# EasyEDA Pro project busmaster-v102.eprj, board bus-board
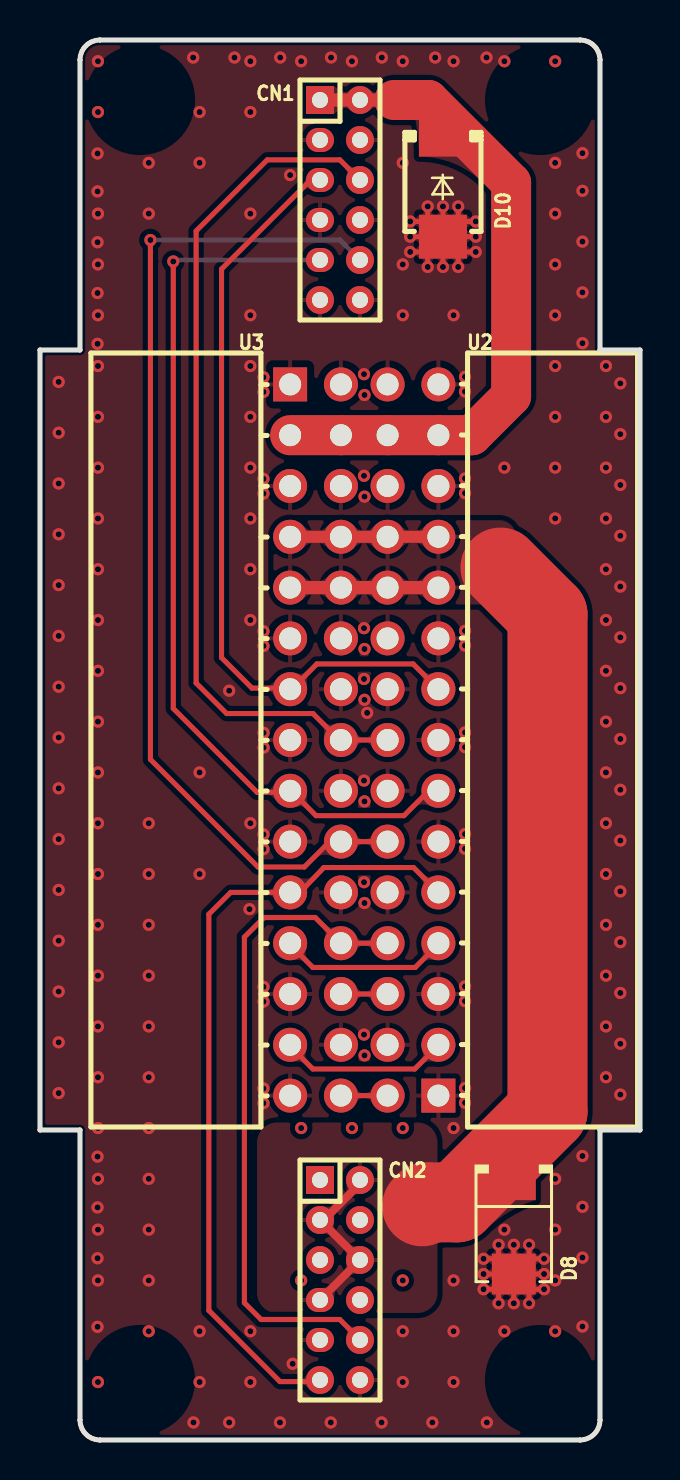
[diagram p3: board, top side]
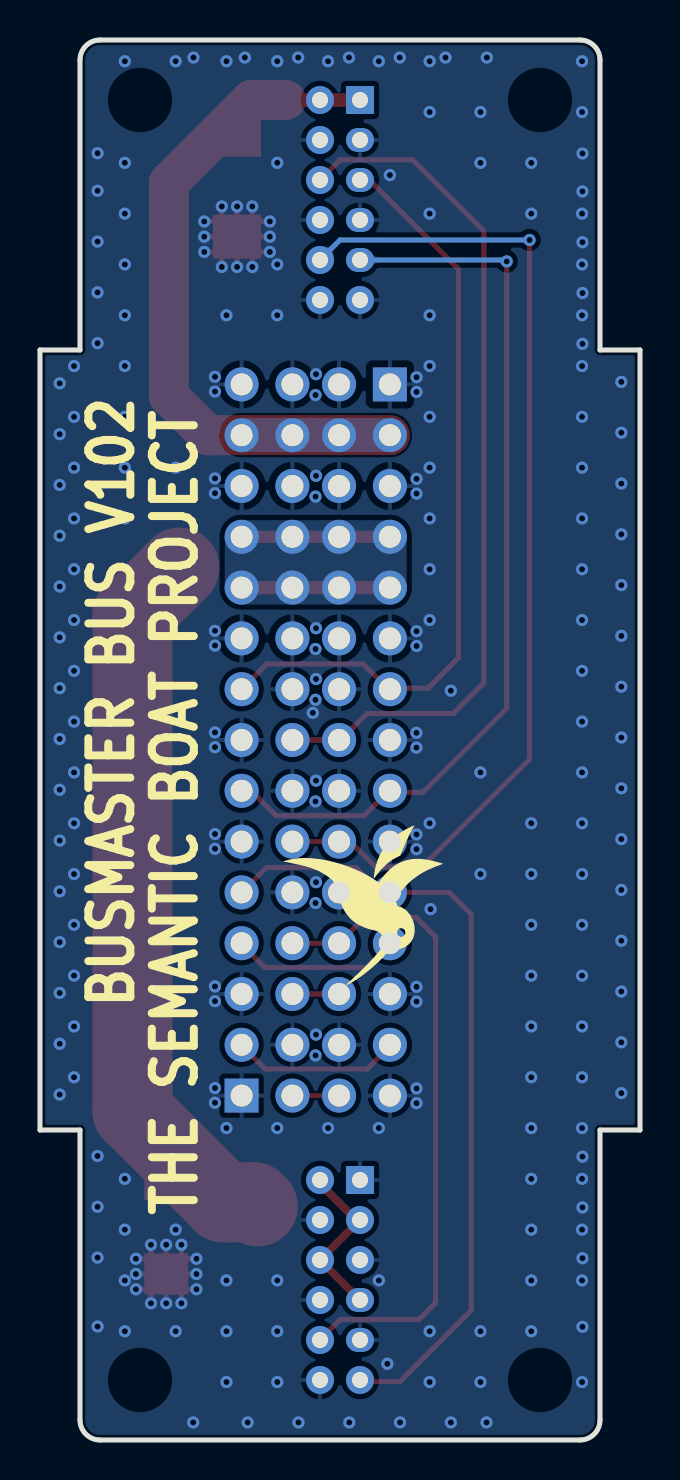
[diagram p4: board, bottom side, seen from below]

Outline 30 x 70 mm; copper layers: Top Layer, Bottom Layer. Coordinates in mm from the lower left corner of the outline.
Outline path: 0,54.5 2,54.5 2,69 arc(2.29,69.71) 3,70 27,70 arc(27.71,69.71) 28,69 28,54.5 30,54.5 30,15.5 28,15.5 28,1 arc(27.71,0.29) 27,0 3,0 arc(2.29,0.29) 2,1 2,15.5 0,15.5 0,54.5
Stack: Top Layer 0.035mm / Dielectric1 1.51mm FR4 er 4.5 / Bottom Layer 0.035mm

## Design rules (mm)
net GND: power
net +5V: power
net +12V: power
template: Custom Config
spacing copperThickness1oz (default): track to track 0.102, other pairs 0.152 to 0.3
spacing copperThickness2oz: track to track 0.203, other pairs 0.152 to 0.3
spacing copperThicknessInner0.5oz: track to track 0.089, other pairs 0.152 to 0.3
track width copperThickness1oz (default): min 0.102, default 0.254, max 5
track width copperThickness2oz: min 0.203, default 0.254, max 2.54
track width copperThickness0.5oz: min 0.089, default 0.254, max 2.54
differential pair differentialPair (default): width min 0.127, default 0.254, max 2.54; gap min 0.152, default 0.152
via viaSize (default): diameter min 0.3, default 0.61, max 10; hole min 0.2, default 0.305, max 6.3

## Placement (name value [footprint] x y rotation side)
CN1  PH2.0-01-06PZS  [HDR-TH_12P-P2.00-V-M-R2-C6-S2.00#2]  15 62 270 top
CN2  PH2.0-01-06PZS  [HDR-TH_12P-P2.00-V-M-R2-C6-S2.00]  15 8 270 top
D8  SMBJ5.0A  [SMB_L4.6-W3.6-LS5.3-RD]  23.69 10.66 270 top
D10  P6SMB20A  [SMB_L4.5-W3.6-LS5.4-RD]  20.15 62.72 270 top
U2  PM254-2-15-W-8.5  [HDR-TH_30P-P2.54-H-F-R2-C15-W8.5]  18.65 35 90 top
U3  PM254-2-15-W-8.5  [HDR-TH_30P-P2.54-H-F-R2-C15-W8.5]  13.78 35 270 top

## Footprints (pads in the part's own frame, mm; a bottom-side part is the same pattern mirrored in y, then rotated)
HDR-TH_12P-P2.00-V-M-R2-C6-S2.00
  rect 1.4x1.4 hole 0.8: 1(-5,-1)
  round 1.4 hole 0.8: 2(-5,1) 3(-3,-1) 4(-3,1) 5(-1,-1) 6(-1,1) 8(1,1) 10(3,1) 11(5,-1) 12(5,1)
  oval 1.2x1.4 hole 0.8: 7(1,-1) 9(3,-1)
HDR-TH_12P-P2.00-V-M-R2-C6-S2.00#2
  rect 1.4x1.4 hole 0.8: 1(-5,-1)
  round 1.4 hole 0.8: 2(-5,1) 4(-3,1) 6(-1,1) 8(1,1) 10(3,1) 11(5,-1) 12(5,1)
  oval 1.2x1.4 hole 0.8: 3(-3,-1) 5(-1,-1) 7(1,-1) 9(3,-1)
HDR-TH_30P-P2.54-H-F-R2-C15-W8.5
  rect 1.7x1.7 hole 1.1: 1(-17.78,-1.27)
  round 1.7 hole 1.1: 2(-17.78,1.27) 3(-15.24,-1.27) 4(-15.24,1.27) 5(-12.7,-1.27) 6(-12.7,1.27) 7(-10.16,-1.27) 8(-10.16,1.27) 9(-7.62,-1.27) 10(-7.62,1.27) 11(-5.08,-1.27) 12(-5.08,1.27) 13(-2.54,-1.27) 14(-2.54,1.27) 15(0,-1.27) 16(0,1.27) 17(2.54,-1.27) 18(2.54,1.27) 19(5.08,-1.27) 20(5.08,1.27) 21(7.62,-1.27) 22(7.62,1.27) 23(10.16,-1.27) 24(10.16,1.27) 25(12.7,-1.27) 26(12.7,1.27) 27(15.24,-1.27) 28(15.24,1.27) 29(17.78,-1.27) 30(17.78,1.27)
SMB_L4.5-W3.6-LS5.4-RD
  rect 2.2x2.4 smd: 1(-2.551,0) 2(2.551,0)
SMB_L4.6-W3.6-LS5.3-RD
  rect 2.047x2.192 smd: 1(-2.361,0) 2(2.361,0)

## Nets
As in the schematic.

## Via types
v1: diameter 0.61, hole 0.305, Top Layer to Bottom Layer, 243 vias

## Routing (per net, layer and track width the routed paths; a pad name or vN(x,y) marks a point on that pad's centre or on a via; arc(x,y) is an arc through that point)
+5V: length 59.8
  Top Layer w0.4: CN2.2 16,12.82 14.18,11 CN2.3 CN2.6 CN2.7
  Top Layer w0.61: U3.7 U3.8 U2.24 U2.23
  Top Layer w0.66: U2.21 U2.22 U3.10 U3.9
  Top Layer w4: 23.02,43.62 25.38,41.27 25.38,16.42 20.83,11.88 19.31,11.88 19.11,11.68
+12V: length 33.3
  Top Layer w0.66: CN1.1 CN1.2 17.21,67
  Top Layer w2: U3.3 U3.4 U2.28 U2.27 21.6,50.24 23.56,52.2 23.56,62.86 19.42,67 17.71,67
GND: length 27.2
  Top Layer w0.254: v1(20.15,61.68) D10.2 ; D10.2 v1(21.79,60.17) ; D10.2 v1(18.51,60.17) ; D10.2 v1(20.15,58.65) ; D10.2 20.91,59.4 ; v1(22.18,9.06) 22.93,9.06 v1(22.93,9.76) ; v1(18.51,59.4) 19.39,59.4 v1(19.39,58.65) ; v1(21.79,59.4) 20.91,59.4 ; 20.91,59.4 v1(20.91,58.65) ; v1(25.2,7.54) 24.45,7.54 v1(24.45,6.84) ; v1(22.93,6.84) 22.93,7.54 v1(22.18,7.54) ; 24.45,9.06 D8.2 ; 24.45,9.06 v1(24.45,9.76) ; 24.45,9.06 v1(25.2,9.06) ; D8.2 v1(22.18,8.3) ; D8.2 v1(23.69,6.84) ; D8.2 v1(25.2,8.3) ; D8.2 v1(23.69,9.76) ; v1(19.39,61.68) 19.39,60.93 v1(18.51,60.93) ; v1(21.79,60.93) 20.91,60.93 v1(20.91,61.68) ; 16.36,64.64 CN1.4
  vias: v1(0.93,52.9) v1(0.93,50.36) v1(0.93,47.82) v1(0.93,45.28) v1(0.93,42.74) v1(0.93,40.2) v1(0.93,37.66) v1(0.93,35.12) v1(0.93,32.58) v1(0.93,30.04) v1(0.93,27.5) v1(0.93,24.96) v1(0.93,22.42) v1(0.93,19.88) v1(0.93,17.34) v1(2.9,68.94) v1(2.9,66.4) v1(2.88,64.33) v1(2.88,62.43) v1(2.9,61.32) v1(2.88,59.89) v1(2.9,58.78) v1(2.88,57.35) v1(2.9,56.24) v1(2.88,54.81) v1(2.9,53.7) v1(2.9,51.16) v1(2.9,48.62) v1(2.9,46.08) v1(2.9,43.54) v1(2.9,41) v1(2.9,38.46) v1(2.9,35.92) v1(2.9,33.38) v1(2.9,30.84) v1(2.9,28.3) v1(2.9,25.76) v1(2.9,23.22) v1(2.9,20.68) v1(2.9,18.14) v1(2.9,15.6) v1(2.88,14.17) v1(2.9,13.06) v1(2.88,11.63) v1(2.9,10.52) v1(2.88,9.09) v1(2.9,7.98) v1(2.88,5.66) v1(2.9,2.9) v1(5.44,63.86) v1(5.44,61.32) v1(5.44,30.84) v1(5.44,28.3) v1(5.44,25.76) v1(5.44,23.22) v1(5.44,20.68) v1(5.44,18.14) v1(5.44,15.6) v1(5.44,13.06) v1(5.44,10.52) v1(5.44,7.98) v1(5.44,5.44) v1(7.66,69.12) v1(7.67,0.88) v1(7.98,66.4) v1(7.98,63.86) v1(7.98,33.38) v1(7.98,28.3) v1(7.98,5.44) v1(7.98,2.9) v1(9.46,37.47) v1(9.46,0.88) v1(9.72,69.12) v1(10.52,68.94) v1(10.52,66.4) v1(10.52,61.32) v1(10.52,56.24) v1(10.52,53.7) v1(10.52,51.16) v1(10.52,48.62) v1(10.52,46.08) v1(10.52,43.54) v1(10.52,41) v1(10.52,30.84) v1(10.47,26.54) v1(10.52,5.44) v1(10.52,2.9) v1(11.17,53.14) v1(11.17,52.4) v1(11.17,48.06) v1(11.17,47.32) v1(11.17,40.44) v1(11.17,39.7) v1(11.18,35.36) v1(11.18,34.62) v1(11.17,30.28) v1(11.17,29.54) v1(11.18,22.66) v1(11.18,21.92) v1(11.17,17.58) v1(11.17,16.84) v1(12.01,69.12) v1(12,0.88) v1(12.51,63.25) v1(12.63,3.81) v1(13.06,68.94) v1(13.06,15.6) v1(13.06,7.98) v1(14.54,0.88) v1(14.55,69.12) v1(15.6,68.94) v1(15.6,15.6) v1(16.2,53.29) v1(16.22,52.25) v1(16.2,48.21) v1(16.22,47.17) v1(16.2,40.59) v1(16.22,39.55) v1(16.2,38.05) v1(16.22,37.01) v1(16.2,32.97) v1(16.22,31.93) v1(16.2,27.89) v1(16.22,26.85) v1(16.2,20.27) v1(16.22,19.23) v1(16.36,36.36) v1(17.09,69.12) v1(17.08,0.88) v1(18.14,68.94) v1(18.14,63.86) v1(18.14,58.78) v1(18.14,56.24) v1(18.14,15.6) v1(18.14,7.98) v1(18.14,5.44) v1(18.14,2.9) v1(19.62,0.88) v1(19.76,69.12) v1(20.68,68.94) v1(20.68,56.24) v1(20.68,15.6) v1(20.68,7.98) v1(20.68,5.44) v1(20.68,2.9) v1(21.25,53.16) v1(21.25,52.42) v1(21.25,48.08) v1(21.25,47.34) v1(21.25,40.46) v1(21.25,39.72) v1(21.25,35.38) v1(21.25,34.64) v1(21.25,30.3) v1(21.25,29.56) v1(21.25,22.68) v1(21.25,21.94) v1(21.25,17.6) v1(21.25,16.86) v1(22.33,69.12) v1(22.34,0.88) v1(23.22,68.94) v1(23.22,48.62) v1(23.22,10.52) v1(23.22,5.44) v1(25.76,68.94) v1(25.76,63.86) v1(25.76,61.32) v1(25.76,58.78) v1(25.76,56.24) v1(25.76,53.7) v1(25.76,51.16) v1(25.76,48.62) v1(25.76,46.08) v1(25.76,13.06) v1(25.76,10.52) v1(25.76,7.98) v1(25.76,5.44) v1(27.12,64.34) v1(27.12,62.46) v1(27.12,59.92) v1(27.12,57.38) v1(27.12,54.84) v1(27.12,14.2) v1(27.12,11.66) v1(27.12,9.12) v1(27.12,5.67) v1(28.3,53.7) v1(28.3,51.16) v1(28.3,48.62) v1(28.3,46.08) v1(28.3,43.54) v1(28.3,41) v1(28.3,38.46) v1(28.3,35.92) v1(28.3,33.38) v1(28.3,30.84) v1(28.3,28.3) v1(28.3,25.76) v1(28.3,23.22) v1(28.3,20.68) v1(28.3,18.14) v1(29.02,52.83) v1(29.02,50.29) v1(29.02,47.75) v1(29.02,45.21) v1(29.02,42.67) v1(29.02,40.13) v1(29.02,37.59) v1(29.02,35.05) v1(29.02,32.51) v1(29.02,29.97) v1(29.02,27.43) v1(29.02,24.89) v1(29.02,22.35) v1(29.02,19.81) v1(29.02,17.27)
SB_RES0: length 32.9
  Top Layer w0.254: CN2.10 16,5.01 14.99,6.03 11.05,6.03 10.22,6.86 10.22,25.15 11.2,26.12 13.76,26.12 U3.24 U2.8
SB_RES1: length 39.8
  Top Layer w0.254: CN2.11 13.92,2.92 12,2.92 8.44,6.48 8.44,26.29 9.53,27.38 U3.21 13.01,27.39 14.19,28.62 18.68,28.62 U2.9
SB_RES2: length 2.3
  Top Layer w0.254: U3.26 U2.6
SB_RES3: length 8.3
  Top Layer w0.254: U2.7 19.92,24.79 18.76,23.63 13.65,23.63 12.57,24.7
SB_RES4: length 2.3
  Top Layer w0.254: U3.30 U2.2
SB_RES5: length 8.5
  Top Layer w0.254: U2.3 19.92,19.73 18.74,18.55 13.64,18.55 12.43,19.76
SMBUS_ALERT: length 45.7
  Top Layer w0.254: U2.13 19.44,32.46 18.19,31.22 13.8,31.22 12.56,32.46 ; v1(6.66,58.93) 6.66,36.58 10.85,32.39 12.43,32.39 U3.17
  Bottom Layer w0.254: CN1.9 6.74,59 v1(6.66,58.93)
SMBUS_CLK: length 43.4
  Top Layer w0.254: U2.16 U3.16 14.97,35 13.65,36.32 9.33,36.32 7.81,37.85 7.81,60.45 11.36,64.01 14.99,64.01 CN1.6
SMBUS_DATA: length 51.5
  Top Layer w0.254: v1(5.52,60) 5.52,34.03 10.9,28.65 13.22,28.65 14.49,29.92 U3.20 U2.12
  Bottom Layer w0.254: CN1.10 15,60 v1(5.52,60)
STACK_ENABLED: length 38.7
  Top Layer w0.254: U2.17 18.66,38.8 13.84,38.8 12.58,37.54 ; U3.13 12.45,37.59 10.6,37.59 9.08,39.12 9.08,58.55 13.53,63 CN1.5

## Copper pours and planes (outline as drawn; the poured copper is in the pictures)
+5V on Top Layer: 10.85,14.88 10.87,15.05 10.93,15.25 11.02,15.43 11.15,15.58 11.3,15.71 11.48,15.8 11.68,15.86 11.85,15.88 18.87,15.88 19.05,15.86 19.24,15.8 19.42,15.71 19.58,15.58 19.71,15.43 19.8,15.25 19.86,15.05 19.87,14.88 19.87,7.35 19.86,7.17 19.8,6.98 19.71,6.8 19.58,6.64 19.42,6.52 19.24,6.42 19.05,6.37 18.87,6.35 11.85,6.35 11.68,6.37 11.48,6.42 11.3,6.52 11.15,6.64 11.02,6.8 10.93,6.98 10.87,7.17 10.85,7.35
+5V on Top Layer: 11.67,45.14 11.67,45.26 11.72,45.44 11.8,45.6 11.92,45.74 12.06,45.86 12.22,45.94 12.4,45.98 12.52,45.99 22.96,45.99 23.07,45.98 23.25,45.94 23.42,45.86 23.56,45.74 23.68,45.6 23.76,45.44 23.8,45.26 23.81,45.14 23.81,42.63 23.8,42.51 23.76,42.33 23.68,42.17 23.56,42.02 23.42,41.91 23.25,41.83 23.07,41.78 22.96,41.78 12.52,41.78 12.4,41.78 12.22,41.83 12.06,41.91 11.92,42.02 11.8,42.17 11.72,42.33 11.67,42.51 11.67,42.63
+5V on Bottom Layer: 11.67,45.99 20.76,45.99 20.76,41.78 11.67,41.78
+12V on Bottom Layer: 11.67,51.1 20.76,51.1 20.76,49.39 11.67,49.39
GND on Top Layer: -2.61,72.39 32.32,72.39 32.32,-1.91 -2.61,-1.91
GND on Bottom Layer: -2.78,71.67 31.51,71.67 31.51,-2.38 -2.78,-2.38

Small or netless copper shapes (teardrops, artwork), in the pictures only: 104 on Top Layer, 4 on Bottom Layer

## Text on the board
Bottom Silkscreen Layer: THE SEMANTIC BOAT PROJECT | BUSMASTER BUS V102
